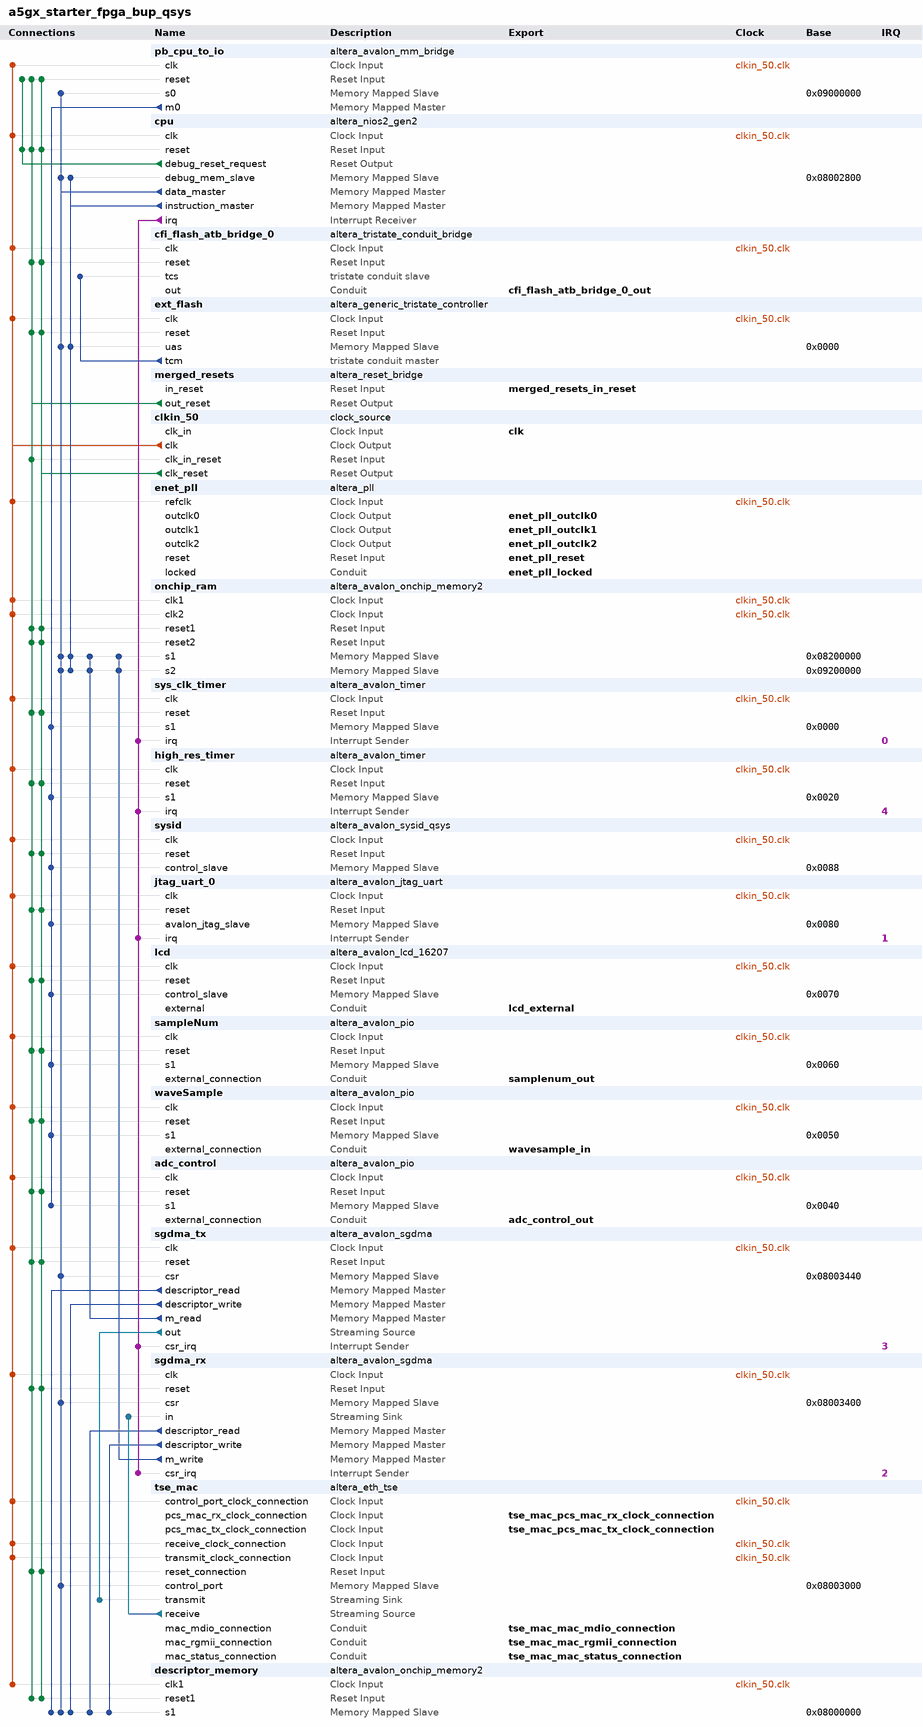
[diagram p0: system contents]
# Platform Designer (Qsys) system a5gx_starter_fpga_bup_qsys, Arria V 5AGXFB3H4F35C4
# Parameters at their usual value, and those the tool derives, are not listed.
package require -exact qsys 16.1
create_system a5gx_starter_fpga_bup_qsys
set_project_property DEVICE_FAMILY {Arria V}
set_project_property DEVICE 5AGXFB3H4F35C4

add_instance pb_cpu_to_io altera_avalon_mm_bridge 16.1
set_instance_parameter_value pb_cpu_to_io ADDRESS_UNITS SYMBOLS
set_instance_parameter_value pb_cpu_to_io ADDRESS_WIDTH 10
set_instance_parameter_value pb_cpu_to_io DATA_WIDTH 32
set_instance_parameter_value pb_cpu_to_io MAX_PENDING_RESPONSES 19
set_instance_parameter_value pb_cpu_to_io USE_AUTO_ADDRESS_WIDTH 0

add_instance cpu altera_nios2_gen2 16.1
set_instance_parameter_value cpu dcache_size 32768
set_instance_parameter_value cpu exceptionOffset 96
set_instance_parameter_value cpu exceptionSlave onchip_ram.s1
set_instance_parameter_value cpu icache_size 32768
set_instance_parameter_value cpu impl Fast
set_instance_parameter_value cpu resetOffset 78118912
set_instance_parameter_value cpu resetSlave ext_flash.uas

add_instance cfi_flash_atb_bridge_0 altera_tristate_conduit_bridge 16.1

add_instance ext_flash altera_generic_tristate_controller 16.1
set_instance_parameter_value ext_flash ACTIVE_LOW_BEGINTRANSFER 0
set_instance_parameter_value ext_flash ACTIVE_LOW_BYTEENABLE 0
set_instance_parameter_value ext_flash ACTIVE_LOW_OUTPUTENABLE 0
set_instance_parameter_value ext_flash ACTIVE_LOW_READ 1
set_instance_parameter_value ext_flash CHIPSELECT_THROUGH_READLATENCY 1
set_instance_parameter_value ext_flash INTERFACE_ASSIGNMENT_KEYS embeddedsw.configuration.isFlash,embeddedsw.configuration.isMemoryDevice,embeddedsw.configuration.isNonVolatileStorage
set_instance_parameter_value ext_flash INTERFACE_ASSIGNMENT_VALUES 1,1,1
set_instance_parameter_value ext_flash IS_MEMORY_DEVICE 0
set_instance_parameter_value ext_flash MODULE_ASSIGNMENT_KEYS embeddedsw.configuration.hwClassnameDriverSupportList,embeddedsw.configuration.hwClassnameDriverSupportDefault,embeddedsw.CMacro.SETUP_VALUE,embeddedsw.CMacro.WAIT_VALUE,embeddedsw.CMacro.HOLD_VALUE,embeddedsw.CMacro.TIMING_UNITS,embeddedsw.CMacro.SIZE,embeddedsw.memoryInfo.MEM_INIT_DATA_WIDTH,embeddedsw.memoryInfo.HAS_BYTE_LANE,embeddedsw.memoryInfo.IS_FLASH,embeddedsw.memoryInfo.GENERATE_DAT_SYM,embeddedsw.memoryInfo.GENERATE_FLASH,embeddedsw.memoryInfo.DAT_SYM_INSTALL_DIR,embeddedsw.memoryInfo.FLASH_INSTALL_DIR
set_instance_parameter_value ext_flash MODULE_ASSIGNMENT_VALUES "altera_avalon_lan91c111\\,altera_avalon_cfi_flash,altera_avalon_cfi_flash,75,35,1,\"ns\",67108864u,16,1,1,1,SIM_DIR,APP_DIR,"
set_instance_parameter_value ext_flash TCM_ADDRESS_W 27
set_instance_parameter_value ext_flash TCM_BYTEENABLE_W 2
set_instance_parameter_value ext_flash TCM_DATA_HOLD 20
set_instance_parameter_value ext_flash TCM_DATA_W 16
set_instance_parameter_value ext_flash TCM_MAX_PENDING_READ_TRANSACTIONS 3
set_instance_parameter_value ext_flash TCM_READLATENCY 2
set_instance_parameter_value ext_flash TCM_READ_WAIT 135
set_instance_parameter_value ext_flash TCM_SETUP_WAIT 25
set_instance_parameter_value ext_flash TCM_SYMBOLS_PER_WORD 2
set_instance_parameter_value ext_flash TCM_TIMING_UNITS 0
set_instance_parameter_value ext_flash TCM_TURNAROUND_TIME 2
set_instance_parameter_value ext_flash TCM_WRITE_WAIT 135
set_instance_parameter_value ext_flash USE_BEGINTRANSFER 0
set_instance_parameter_value ext_flash USE_BYTEENABLE 0
set_instance_parameter_value ext_flash USE_OUTPUTENABLE 0
set_instance_parameter_value ext_flash USE_READ 1

add_instance merged_resets altera_reset_bridge 16.1
set_instance_parameter_value merged_resets ACTIVE_LOW_RESET 1
set_instance_parameter_value merged_resets SYNCHRONOUS_EDGES none

add_instance clkin_50 clock_source 16.1
set_instance_parameter_value clkin_50 clockFrequency 50000000

add_instance enet_pll altera_pll 16.1
set_instance_parameter_value enet_pll gui_device_speed_grade 1
set_instance_parameter_value enet_pll gui_number_of_clocks 3
set_instance_parameter_value enet_pll gui_operation_mode normal
set_instance_parameter_value enet_pll gui_output_clock_frequency0 125.0
set_instance_parameter_value enet_pll gui_output_clock_frequency1 25.0
set_instance_parameter_value enet_pll gui_output_clock_frequency2 2.5
set_instance_parameter_value enet_pll gui_pll_mode {Integer-N PLL}
set_instance_parameter_value enet_pll gui_reference_clock_frequency 50.0
set_instance_parameter_value enet_pll gui_use_locked true

add_instance onchip_ram altera_avalon_onchip_memory2 16.1
set_instance_parameter_value onchip_ram dataWidth 32
set_instance_parameter_value onchip_ram dualPort true
set_instance_parameter_value onchip_ram initMemContent true
set_instance_parameter_value onchip_ram initializationFileName onchip_mem.hex
set_instance_parameter_value onchip_ram memorySize 1572864

add_instance sys_clk_timer altera_avalon_timer 16.1
set_instance_parameter_value sys_clk_timer period 10
set_instance_parameter_value sys_clk_timer periodUnits MSEC

add_instance high_res_timer altera_avalon_timer 16.1
set_instance_parameter_value high_res_timer period 10
set_instance_parameter_value high_res_timer periodUnits USEC

add_instance sysid altera_avalon_sysid_qsys 16.1
set_instance_parameter_value sysid id -87110914

add_instance jtag_uart_0 altera_avalon_jtag_uart 16.1
set_instance_parameter_value jtag_uart_0 simInteractiveOptions NO_INTERACTIVE_WINDOWS

add_instance lcd altera_avalon_lcd_16207 16.1

add_instance sampleNum altera_avalon_pio 16.1
set_instance_parameter_value sampleNum direction Output
set_instance_parameter_value sampleNum resetValue 15
set_instance_parameter_value sampleNum width 16

add_instance waveSample altera_avalon_pio 16.1
set_instance_parameter_value waveSample direction Input
set_instance_parameter_value waveSample width 16

add_instance adc_control altera_avalon_pio 16.1
set_instance_parameter_value adc_control direction Output
set_instance_parameter_value adc_control width 8

add_instance sgdma_tx altera_avalon_sgdma 16.1
set_instance_parameter_value sgdma_tx enableBurstTransfers false
set_instance_parameter_value sgdma_tx enableUnalignedTransfers false
set_instance_parameter_value sgdma_tx readBlockDataWidth 32
set_instance_parameter_value sgdma_tx sinkErrorWidth 0
set_instance_parameter_value sgdma_tx sourceErrorWidth 1
set_instance_parameter_value sgdma_tx transferMode MEMORY_TO_STREAM
set_instance_parameter_value sgdma_tx writeBurstcountWidth 4

add_instance sgdma_rx altera_avalon_sgdma 16.1
set_instance_parameter_value sgdma_rx enableBurstTransfers false
set_instance_parameter_value sgdma_rx enableUnalignedTransfers false
set_instance_parameter_value sgdma_rx readBlockDataWidth 32
set_instance_parameter_value sgdma_rx sinkErrorWidth 6
set_instance_parameter_value sgdma_rx sourceErrorWidth 0
set_instance_parameter_value sgdma_rx transferMode STREAM_TO_MEMORY
set_instance_parameter_value sgdma_rx writeBurstcountWidth 4

add_instance tse_mac altera_eth_tse 16.1
set_instance_parameter_value tse_mac core_variation MAC_ONLY
set_instance_parameter_value tse_mac eg_addr 12
set_instance_parameter_value tse_mac ena_hash true
set_instance_parameter_value tse_mac enable_hd_logic true
set_instance_parameter_value tse_mac enable_mac_flow_ctrl true
set_instance_parameter_value tse_mac enable_magic_detect false
set_instance_parameter_value tse_mac enable_shift16 true
set_instance_parameter_value tse_mac ifGMII RGMII
set_instance_parameter_value tse_mac ing_addr 12
set_instance_parameter_value tse_mac mdio_clk_div 30
set_instance_parameter_value tse_mac stat_cnt_ena true
set_instance_parameter_value tse_mac transceiver_type NONE

add_instance descriptor_memory altera_avalon_onchip_memory2 16.1
set_instance_parameter_value descriptor_memory dataWidth 32
set_instance_parameter_value descriptor_memory dualPort false
set_instance_parameter_value descriptor_memory initMemContent true
set_instance_parameter_value descriptor_memory initializationFileName onchip_mem.hex
set_instance_parameter_value descriptor_memory memorySize 8192

# connections
add_connection clkin_50.clk adc_control.clk clock
add_connection clkin_50.clk cfi_flash_atb_bridge_0.clk clock
add_connection clkin_50.clk cpu.clk clock
add_connection clkin_50.clk descriptor_memory.clk1 clock
add_connection clkin_50.clk enet_pll.refclk clock
add_connection clkin_50.clk ext_flash.clk clock
add_connection clkin_50.clk high_res_timer.clk clock
add_connection clkin_50.clk jtag_uart_0.clk clock
add_connection clkin_50.clk lcd.clk clock
add_connection clkin_50.clk onchip_ram.clk1 clock
add_connection clkin_50.clk onchip_ram.clk2 clock
add_connection clkin_50.clk pb_cpu_to_io.clk clock
add_connection clkin_50.clk sampleNum.clk clock
add_connection clkin_50.clk sgdma_rx.clk clock
add_connection clkin_50.clk sgdma_tx.clk clock
add_connection clkin_50.clk sys_clk_timer.clk clock
add_connection clkin_50.clk sysid.clk clock
add_connection clkin_50.clk tse_mac.control_port_clock_connection clock
add_connection clkin_50.clk tse_mac.receive_clock_connection clock
add_connection clkin_50.clk tse_mac.transmit_clock_connection clock
add_connection clkin_50.clk waveSample.clk clock
add_connection clkin_50.clk_reset adc_control.reset reset
add_connection clkin_50.clk_reset cfi_flash_atb_bridge_0.reset reset
add_connection clkin_50.clk_reset cpu.reset reset
add_connection clkin_50.clk_reset descriptor_memory.reset1 reset
add_connection clkin_50.clk_reset ext_flash.reset reset
add_connection clkin_50.clk_reset high_res_timer.reset reset
add_connection clkin_50.clk_reset jtag_uart_0.reset reset
add_connection clkin_50.clk_reset lcd.reset reset
add_connection clkin_50.clk_reset onchip_ram.reset1 reset
add_connection clkin_50.clk_reset onchip_ram.reset2 reset
add_connection clkin_50.clk_reset pb_cpu_to_io.reset reset
add_connection clkin_50.clk_reset sampleNum.reset reset
add_connection clkin_50.clk_reset sgdma_rx.reset reset
add_connection clkin_50.clk_reset sgdma_tx.reset reset
add_connection clkin_50.clk_reset sys_clk_timer.reset reset
add_connection clkin_50.clk_reset sysid.reset reset
add_connection clkin_50.clk_reset tse_mac.reset_connection reset
add_connection clkin_50.clk_reset waveSample.reset reset
add_connection cpu.debug_reset_request cpu.reset reset
add_connection cpu.debug_reset_request pb_cpu_to_io.reset reset
add_connection merged_resets.out_reset adc_control.reset reset
add_connection merged_resets.out_reset cfi_flash_atb_bridge_0.reset reset
add_connection merged_resets.out_reset clkin_50.clk_in_reset reset
add_connection merged_resets.out_reset cpu.reset reset
add_connection merged_resets.out_reset descriptor_memory.reset1 reset
add_connection merged_resets.out_reset ext_flash.reset reset
add_connection merged_resets.out_reset high_res_timer.reset reset
add_connection merged_resets.out_reset jtag_uart_0.reset reset
add_connection merged_resets.out_reset lcd.reset reset
add_connection merged_resets.out_reset onchip_ram.reset1 reset
add_connection merged_resets.out_reset onchip_ram.reset2 reset
add_connection merged_resets.out_reset pb_cpu_to_io.reset reset
add_connection merged_resets.out_reset sampleNum.reset reset
add_connection merged_resets.out_reset sgdma_rx.reset reset
add_connection merged_resets.out_reset sgdma_tx.reset reset
add_connection merged_resets.out_reset sys_clk_timer.reset reset
add_connection merged_resets.out_reset sysid.reset reset
add_connection merged_resets.out_reset tse_mac.reset_connection reset
add_connection merged_resets.out_reset waveSample.reset reset
add_connection cpu.data_master cpu.debug_mem_slave avalon
set_connection_parameter_value cpu.data_master/cpu.debug_mem_slave baseAddress 0x08002800
add_connection cpu.data_master descriptor_memory.s1 avalon
set_connection_parameter_value cpu.data_master/descriptor_memory.s1 baseAddress 0x08000000
add_connection cpu.data_master ext_flash.uas avalon
set_connection_parameter_value cpu.data_master/ext_flash.uas baseAddress 0x0000
add_connection cpu.data_master onchip_ram.s1 avalon
set_connection_parameter_value cpu.data_master/onchip_ram.s1 baseAddress 0x08200000
add_connection cpu.data_master onchip_ram.s2 avalon
set_connection_parameter_value cpu.data_master/onchip_ram.s2 baseAddress 0x09200000
add_connection cpu.data_master pb_cpu_to_io.s0 avalon
set_connection_parameter_value cpu.data_master/pb_cpu_to_io.s0 baseAddress 0x09000000
add_connection cpu.data_master sgdma_rx.csr avalon
set_connection_parameter_value cpu.data_master/sgdma_rx.csr baseAddress 0x08003400
add_connection cpu.data_master sgdma_tx.csr avalon
set_connection_parameter_value cpu.data_master/sgdma_tx.csr baseAddress 0x08003440
add_connection cpu.data_master tse_mac.control_port avalon
set_connection_parameter_value cpu.data_master/tse_mac.control_port baseAddress 0x08003000
add_connection cpu.instruction_master cpu.debug_mem_slave avalon
set_connection_parameter_value cpu.instruction_master/cpu.debug_mem_slave baseAddress 0x08002800
add_connection cpu.instruction_master ext_flash.uas avalon
set_connection_parameter_value cpu.instruction_master/ext_flash.uas baseAddress 0x0000
add_connection cpu.instruction_master onchip_ram.s1 avalon
set_connection_parameter_value cpu.instruction_master/onchip_ram.s1 baseAddress 0x08200000
add_connection cpu.instruction_master onchip_ram.s2 avalon
set_connection_parameter_value cpu.instruction_master/onchip_ram.s2 baseAddress 0x09200000
add_connection pb_cpu_to_io.m0 adc_control.s1 avalon
set_connection_parameter_value pb_cpu_to_io.m0/adc_control.s1 baseAddress 0x0040
add_connection pb_cpu_to_io.m0 high_res_timer.s1 avalon
set_connection_parameter_value pb_cpu_to_io.m0/high_res_timer.s1 baseAddress 0x0020
add_connection pb_cpu_to_io.m0 jtag_uart_0.avalon_jtag_slave avalon
set_connection_parameter_value pb_cpu_to_io.m0/jtag_uart_0.avalon_jtag_slave baseAddress 0x0080
add_connection pb_cpu_to_io.m0 lcd.control_slave avalon
set_connection_parameter_value pb_cpu_to_io.m0/lcd.control_slave baseAddress 0x0070
add_connection pb_cpu_to_io.m0 sampleNum.s1 avalon
set_connection_parameter_value pb_cpu_to_io.m0/sampleNum.s1 baseAddress 0x0060
add_connection pb_cpu_to_io.m0 sys_clk_timer.s1 avalon
set_connection_parameter_value pb_cpu_to_io.m0/sys_clk_timer.s1 baseAddress 0x0000
add_connection pb_cpu_to_io.m0 sysid.control_slave avalon
set_connection_parameter_value pb_cpu_to_io.m0/sysid.control_slave baseAddress 0x0088
add_connection pb_cpu_to_io.m0 waveSample.s1 avalon
set_connection_parameter_value pb_cpu_to_io.m0/waveSample.s1 baseAddress 0x0050
add_connection sgdma_rx.descriptor_read descriptor_memory.s1 avalon
set_connection_parameter_value sgdma_rx.descriptor_read/descriptor_memory.s1 baseAddress 0x08000000
add_connection sgdma_rx.descriptor_write descriptor_memory.s1 avalon
set_connection_parameter_value sgdma_rx.descriptor_write/descriptor_memory.s1 baseAddress 0x08000000
add_connection sgdma_rx.m_write onchip_ram.s1 avalon
set_connection_parameter_value sgdma_rx.m_write/onchip_ram.s1 baseAddress 0x08200000
add_connection sgdma_rx.m_write onchip_ram.s2 avalon
set_connection_parameter_value sgdma_rx.m_write/onchip_ram.s2 baseAddress 0x09200000
add_connection sgdma_tx.descriptor_read descriptor_memory.s1 avalon
set_connection_parameter_value sgdma_tx.descriptor_read/descriptor_memory.s1 baseAddress 0x08000000
add_connection sgdma_tx.descriptor_write descriptor_memory.s1 avalon
set_connection_parameter_value sgdma_tx.descriptor_write/descriptor_memory.s1 baseAddress 0x08000000
add_connection sgdma_tx.m_read onchip_ram.s1 avalon
set_connection_parameter_value sgdma_tx.m_read/onchip_ram.s1 baseAddress 0x08200000
add_connection sgdma_tx.m_read onchip_ram.s2 avalon
set_connection_parameter_value sgdma_tx.m_read/onchip_ram.s2 baseAddress 0x09200000
add_connection sgdma_tx.out tse_mac.transmit avalon_streaming
add_connection tse_mac.receive sgdma_rx.in avalon_streaming
add_connection cpu.irq high_res_timer.irq interrupt
set_connection_parameter_value cpu.irq/high_res_timer.irq irqNumber 4
add_connection cpu.irq jtag_uart_0.irq interrupt
set_connection_parameter_value cpu.irq/jtag_uart_0.irq irqNumber 1
add_connection cpu.irq sgdma_rx.csr_irq interrupt
set_connection_parameter_value cpu.irq/sgdma_rx.csr_irq irqNumber 2
add_connection cpu.irq sgdma_tx.csr_irq interrupt
set_connection_parameter_value cpu.irq/sgdma_tx.csr_irq irqNumber 3
add_connection cpu.irq sys_clk_timer.irq interrupt
set_connection_parameter_value cpu.irq/sys_clk_timer.irq irqNumber 0
add_connection ext_flash.tcm cfi_flash_atb_bridge_0.tcs tristate_conduit

# exported interfaces
add_interface adc_control_out conduit end
set_interface_property adc_control_out EXPORT_OF adc_control.external_connection
add_interface cfi_flash_atb_bridge_0_out conduit end
set_interface_property cfi_flash_atb_bridge_0_out EXPORT_OF cfi_flash_atb_bridge_0.out
add_interface clk clock sink
set_interface_property clk EXPORT_OF clkin_50.clk_in
add_interface enet_pll_locked conduit end
set_interface_property enet_pll_locked EXPORT_OF enet_pll.locked
add_interface enet_pll_outclk0 clock source
set_interface_property enet_pll_outclk0 EXPORT_OF enet_pll.outclk0
add_interface enet_pll_outclk1 clock source
set_interface_property enet_pll_outclk1 EXPORT_OF enet_pll.outclk1
add_interface enet_pll_outclk2 clock source
set_interface_property enet_pll_outclk2 EXPORT_OF enet_pll.outclk2
add_interface enet_pll_reset reset sink
set_interface_property enet_pll_reset EXPORT_OF enet_pll.reset
add_interface lcd_external conduit end
set_interface_property lcd_external EXPORT_OF lcd.external
add_interface merged_resets_in_reset reset sink
set_interface_property merged_resets_in_reset EXPORT_OF merged_resets.in_reset
add_interface samplenum_out conduit end
set_interface_property samplenum_out EXPORT_OF sampleNum.external_connection
add_interface tse_mac_mac_mdio_connection conduit end
set_interface_property tse_mac_mac_mdio_connection EXPORT_OF tse_mac.mac_mdio_connection
add_interface tse_mac_mac_rgmii_connection conduit end
set_interface_property tse_mac_mac_rgmii_connection EXPORT_OF tse_mac.mac_rgmii_connection
add_interface tse_mac_mac_status_connection conduit end
set_interface_property tse_mac_mac_status_connection EXPORT_OF tse_mac.mac_status_connection
add_interface tse_mac_pcs_mac_rx_clock_connection clock sink
set_interface_property tse_mac_pcs_mac_rx_clock_connection EXPORT_OF tse_mac.pcs_mac_rx_clock_connection
add_interface tse_mac_pcs_mac_tx_clock_connection clock sink
set_interface_property tse_mac_pcs_mac_tx_clock_connection EXPORT_OF tse_mac.pcs_mac_tx_clock_connection
add_interface wavesample_in conduit end
set_interface_property wavesample_in EXPORT_OF waveSample.external_connection

set_interconnect_requirement {$system} qsys_mm.clockCrossingAdapter HANDSHAKE
set_interconnect_requirement {$system} qsys_mm.enableEccProtection FALSE
set_interconnect_requirement {$system} qsys_mm.insertDefaultSlave FALSE
set_interconnect_requirement {$system} qsys_mm.maxAdditionalLatency 1

save_system a5gx_starter_fpga_bup_qsys.qsys
